# Altium schematic sheet MainCircuit.SchDoc
size A4; SheetNumber: 2; SheetTotal: 8
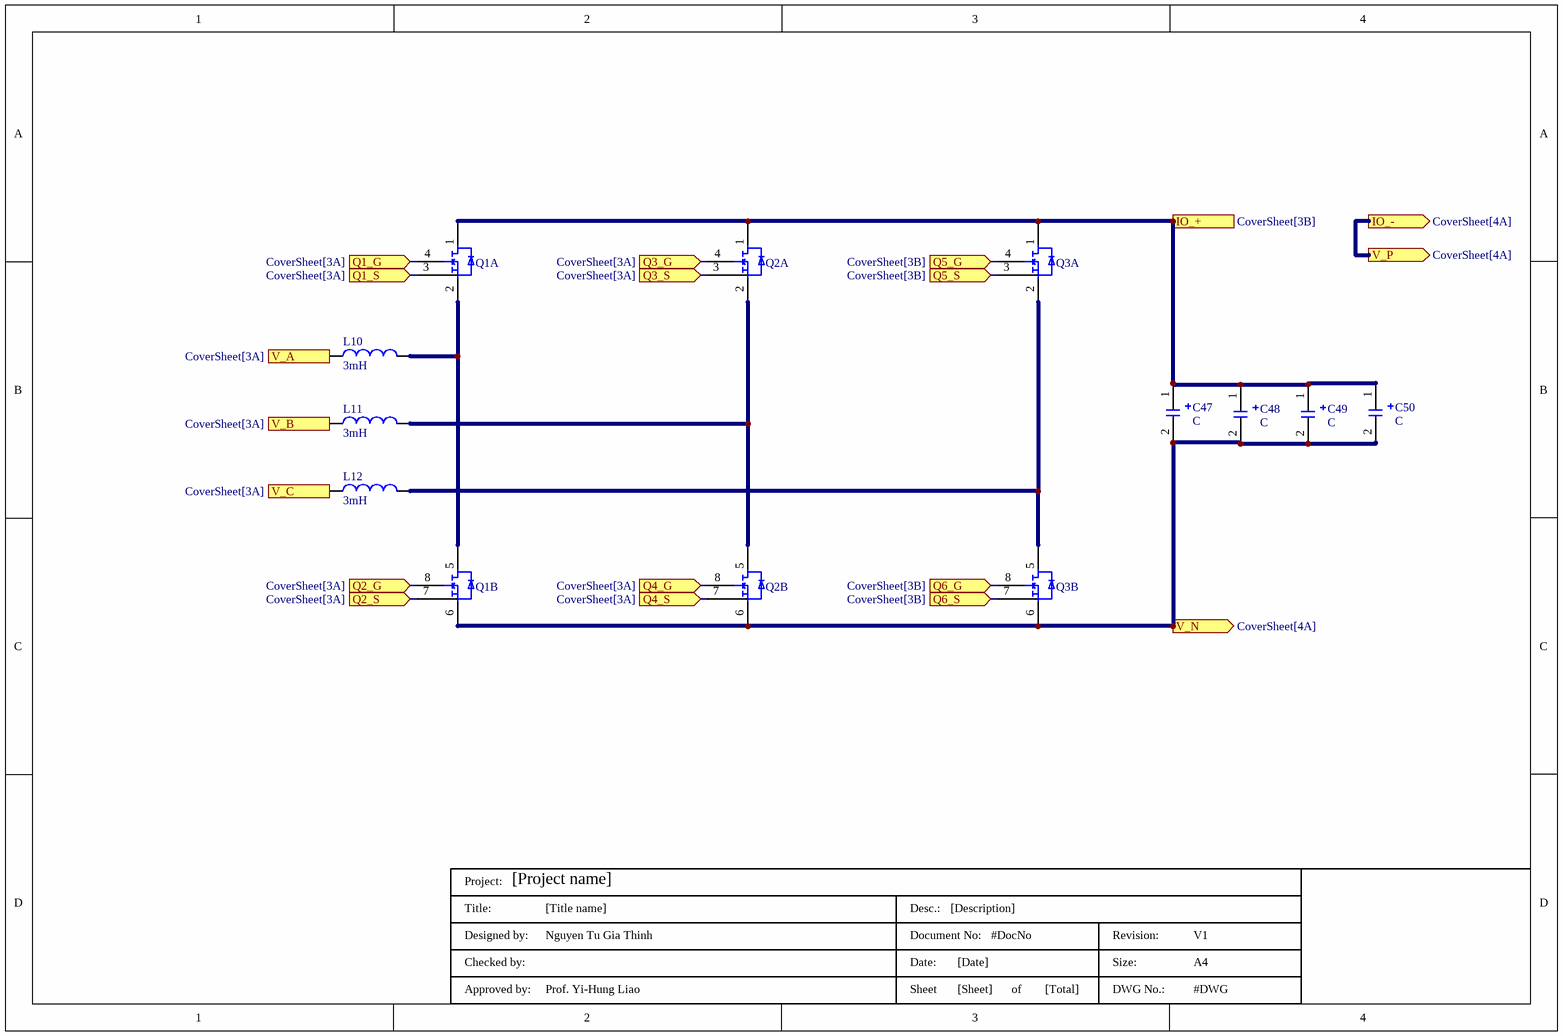
[diagram p0: MainCircuit.SchDoc]

## Parts
C47  C  [CAPACITOR]
C48  C  [CAPACITOR]
C49  C  [CAPACITOR]
C50  C  [CAPACITOR]
L10  value 3mH  [CS467125x2]  (hidden comment: Inductor)
L11  value 3mH  [CS467125x2]  (hidden comment: Inductor)
L12  value 3mH  [CS467125x2]  (hidden comment: Inductor)
Q1  SiC MOS  [C247-050-2VE]  (value not drawn)  (parts A,B of 2)
Q2  SiC MOS  [C247-050-2VE]  (value not drawn)  (parts A,B of 2)
Q3  SiC MOS  [C247-050-2VE]  (value not drawn)  (parts A,B of 2)
TitleBlock  DWG No.: #DWG  Size:: A4  Revision:: V1  Total of Sheets: [Total]  Sheet: [Sheet]  Date:: [Date]  Document No:: #DocNo  Desc.:: [Description]  Approved by:: Prof. Yi-Hung Liao  Designed by:: Nguyen Tu Gia Thinh  Title:: [Title name]  Project: [Project name]  (hidden comment: TitleBlock)  (graphical)

## Ports
IO_+ (in, see CoverSheet[3B]), IO_- (out, see CoverSheet[4A]), Q1_G (in, see CoverSheet[3A]), Q1_S (in, see CoverSheet[3A]), Q2_G (in, see CoverSheet[3A]), Q2_S (in, see CoverSheet[3A]), Q3_G (in, see CoverSheet[3A]), Q3_S (in, see CoverSheet[3A]), Q4_G (in, see CoverSheet[3A]), Q4_S (in, see CoverSheet[3A]), Q5_G (in, see CoverSheet[3B]), Q5_S (in, see CoverSheet[3B]), Q6_G (in, see CoverSheet[3B]), Q6_S (in, see CoverSheet[3B]), V_A (in, see CoverSheet[3A]), V_B (in, see CoverSheet[3A]), V_C (in, see CoverSheet[3A]), V_N (out, see CoverSheet[4A]), V_P (out, see CoverSheet[4A])

## Nets
IO_+: C47.1(+) C48.1(+) C49.1(+) C50.1(+) Q1.1(D) Q2.1(D) Q3.1(D) ; port IO_+
IO_-: port V_P, port IO_-
Q1_G: Q1.4(G) ; port Q1_G
Q1_S: Q1.3(S2) ; port Q1_S
Q2_G: Q1.8(G) ; port Q2_G
Q2_S: Q1.7(S2) ; port Q2_S
Q3_G: Q2.4(G) ; port Q3_G
Q3_S: Q2.3(S2) ; port Q3_S
Q4_G: Q2.8(G) ; port Q4_G
Q4_S: Q2.7(S2) ; port Q4_S
Q5_G: Q3.4(G) ; port Q5_G
Q5_S: Q3.3(S2) ; port Q5_S
Q6_G: Q3.8(G) ; port Q6_G
Q6_S: Q3.7(S2) ; port Q6_S
V_A: L10.1 ; port V_A
V_B: L11.1 ; port V_B
V_C: L12.1 ; port V_C
V_N: C47.2(-) C48.2(-) C49.2(-) C50.2(-) Q1.6(S1) Q2.6(S1) Q3.6(S1) ; port V_N
NetL10_2: L10.2 Q1.2(S1) Q1.5(D)
NetL11_2: L11.2 Q2.2(S1) Q2.5(D)
NetL12_2: L12.2 Q3.2(S1) Q3.5(D)

## Notes on the sheet
- (in symbol Title Block 2) Project:; Title:; Desc.:; Designed by:; Document No:; Revision:; Checked by:; Date:; Size:; Approved by:; Sheet; of; DWG No.:

## Library data of the parts
L10-L12 = CS467125x2: Inductor Powder core CS467125 x2 cores, phi 1.6mm, 1 layer, 74 turns, 3mH.
Q1-Q3 = C247-050-2VE: MOSFETs, N-Channel 1200 V 100A (Tc) 431W (Tc) Through Hole TO-247-4L(X)
TitleBlock = Title Block 2